# Altium schematic sheet CRUVI.SchDoc: CRUVI
size A4; Organization: Trenz Electronic GmbH; DocumentNumber: CR00041; Revision: 01; SheetNumber: 1; SheetTotal: 2; Date: 2019-11-14; CompanyName: Trenz Electronic GmbH
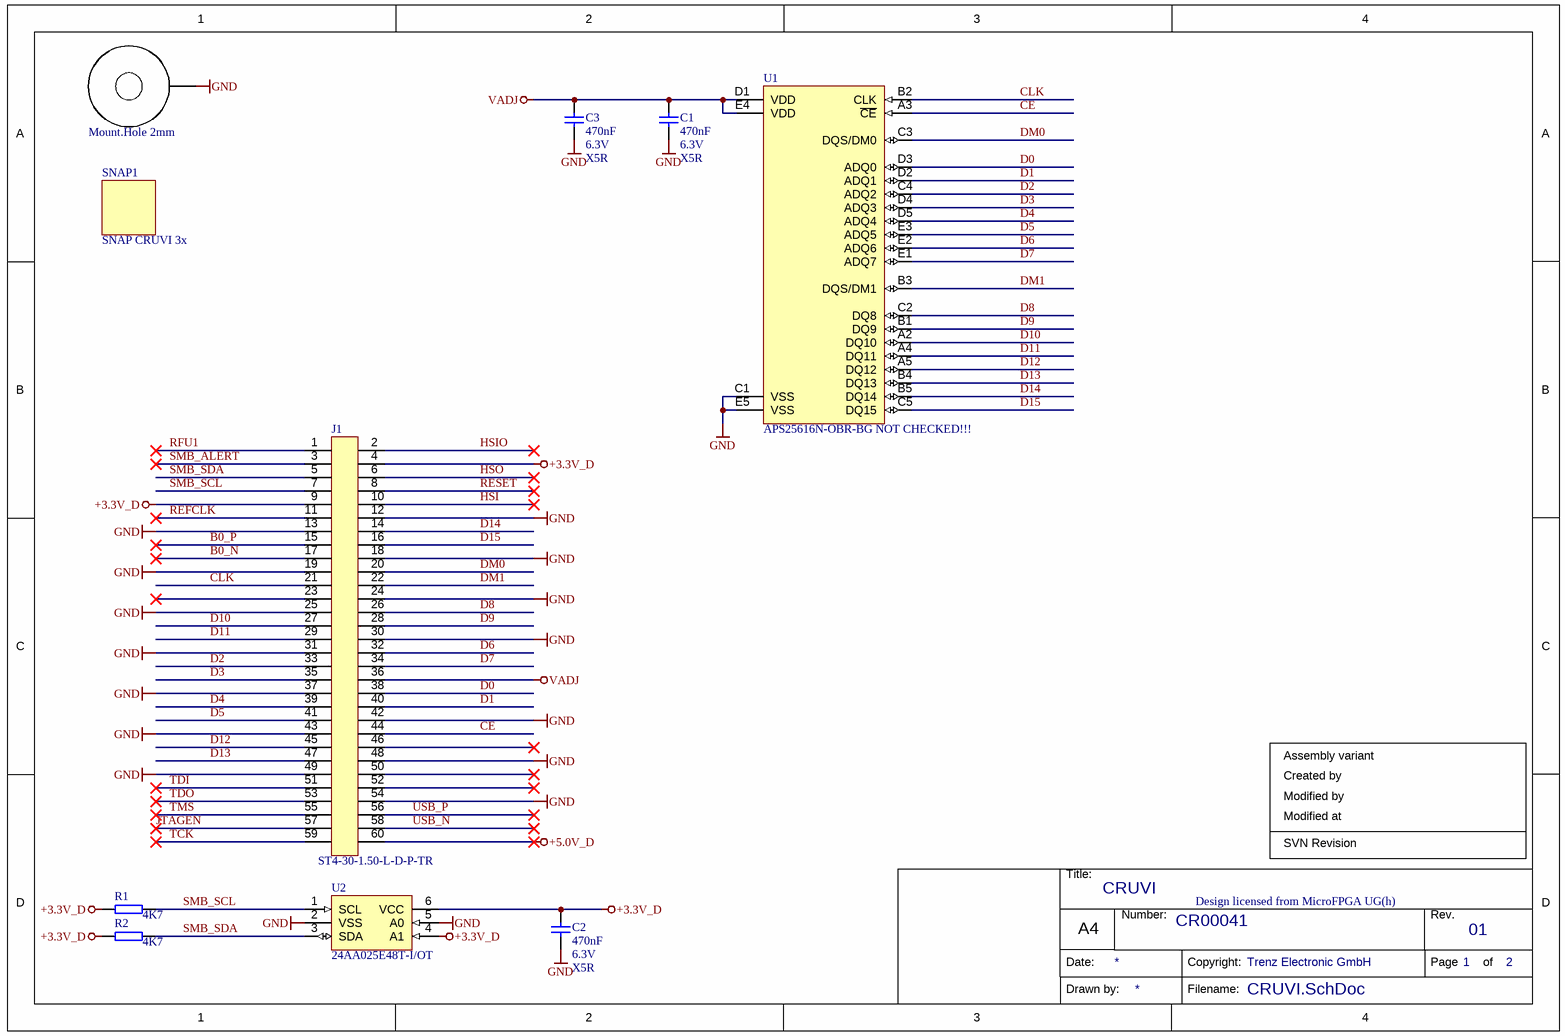
[diagram p0: CRUVI.SchDoc]

## Parts
C1  470nF  Voltage: 6.3V  Technology: X5R  [CAPC1005X55N_V]
C2  470nF  Voltage: 6.3V  Technology: X5R  [CAPC1005X55N_V]
C3  470nF  Voltage: 6.3V  Technology: X5R  [CAPC1005X55N_V]
H3  Mount.Hole 2mm  [MHole2_2mm]  (no BOM)
J1  ST4-30-1.50-L-D-P-TR  [ST4-30-1_50-L-D]
R1  4K7  [RESC1005X40N_V]
R2  4K7  [RESC1005X40N_V]
SNAP1  SNAP CRUVI 3x  [CRUVI_3x_Snap]  (no BOM)
U1  APS25616N-OBR-BG NOT CHECKED!!!  [BGA24C100P5X5_800X600X120N]
U2  24AA025E48T-I/OT  [SOT95P280X145-6N]

## Nets
+3.3V_D: C2.1 J1.4 J1.9 R1.1 R2.1 U2.4(A1) U2.6(VCC)
+5.0V_D: J1.60
GND: C1.2 C2.2 C3.2 H3.1 J1.12 J1.13 J1.18 J1.19 J1.24 J1.25 J1.30 J1.31 J1.37 J1.42 J1.43 J1.48 J1.49 J1.54 U1.C1(VSS) U1.E5(VSS) U2.2(VSS) U2.5(A0)
VADJ: C1.1 C3.1 J1.36 U1.D1(VDD) U1.E4(VDD)
B0_N: J1.17
B0_P: J1.15
CE: J1.44 U1.A3(~{CE})
CLK: J1.21 U1.B2(CLK)
D0: J1.38 U1.D3(ADQ0)
D1: J1.40 U1.D2(ADQ1)
D2: J1.33 U1.C4(ADQ2)
D3: J1.35 U1.D4(ADQ3)
D4: J1.39 U1.D5(ADQ4)
D5: J1.41 U1.E3(ADQ5)
D6: J1.32 U1.E2(ADQ6)
D7: J1.34 U1.E1(ADQ7)
D8: J1.26 U1.C2(DQ8)
D9: J1.28 U1.B1(DQ9)
D10: J1.27 U1.A2(DQ10)
D11: J1.29 U1.A4(DQ11)
D12: J1.45 U1.A5(DQ12)
D13: J1.47 U1.B4(DQ13)
D14: J1.14 U1.B5(DQ14)
D15: J1.16 U1.C5(DQ15)
DM0: J1.20 U1.C3(DQS/DM0)
DM1: J1.22 U1.B3(DQS/DM1)
HSI: J1.10
HSIO: J1.2
HSO: J1.6
JTAGEN: J1.57
REFCLK: J1.11
RESET: J1.8
RFU1: J1.1
SMB_ALERT: J1.3
SMB_SCL: J1.7 R1.2 U2.1(SCL)
SMB_SDA: J1.5 R2.2 U2.3(SDA)
TCK: J1.59
TDI: J1.51
TDO: J1.53
TMS: J1.55
USB_N: J1.58
USB_P: J1.56

Not connected (* = marked no-connect by the designer): J1 23* 46* 50* 52*

## Notes on the sheet
- Assembly variant
- Created by
- Modified at
- Modified by
- SVN Revision
- Design licensed from MicroFPGA UG(h)
- Title:
- Number:
- Rev.
- Date:
- A4
- Copyright:
- Page
- of
- Drawn by:
- Filename:

## Library data of the parts
C1-C3 = 23659: KON 470nF 6,3V X5R SMD BF 1005 (0402); AN: 23659; Mixed: SMT; Value: 470n; Preferred: Yes; Temperature-Range: -55/+85; Case: 1005 (0402)
H3 = 27273: AN: 27273; Mixed: THT
J1 = 29686: AN: 29686; Mixed: SMT; Temperature-Range: -55/+125; Extra: Samtec Ultra-Fine Pitch Header 60 pins, 0.4mm pitch, 1.50 mm height; Case: ST4; HelpURL: b:\AD\adlib\datasheet\Samtec_ST4\; H-ART: ST4-30-1.50-L-D-P-TR
R1 R2 = 22585: WID SMD 4K7 1% 0,063W BF 1005 (0402); AN: 22585; Mixed: SMT; Value: 4.7K; Preferred: Yes; H-ART: RC0402FR-134K7L; Tolerance: 1%; Case: 1005 (0402); Technology: TK100
SNAP1 = 29977: SNAP for CRUVI 3x; AN: 29977
U1 = 30935: APS25616N-OBR-BG; AN: 30935; Mixed: SMT; Trenz-Stock: Yes; Extra: 1.8V, 200Mhz, xxMbit (xxMByte) Octal SPI PSRAM; Case: BGA25; HelpURL: b:\AD\adlib\datasheet\NDA\APSxxxXXN-OBRx\; H-ART: APS25616N-OBR-BG
U2 = 26249: AN: 26249; Mixed: SMT; Temperature-Range: -40/+85; Extra: 2K i2c Serial EEPROM with EUI-48; Case: SOT23-6; HelpURL: B:\AD\adlib\datasheet\24AA02xExx; H-ART: 24AA025E48T-I/OT